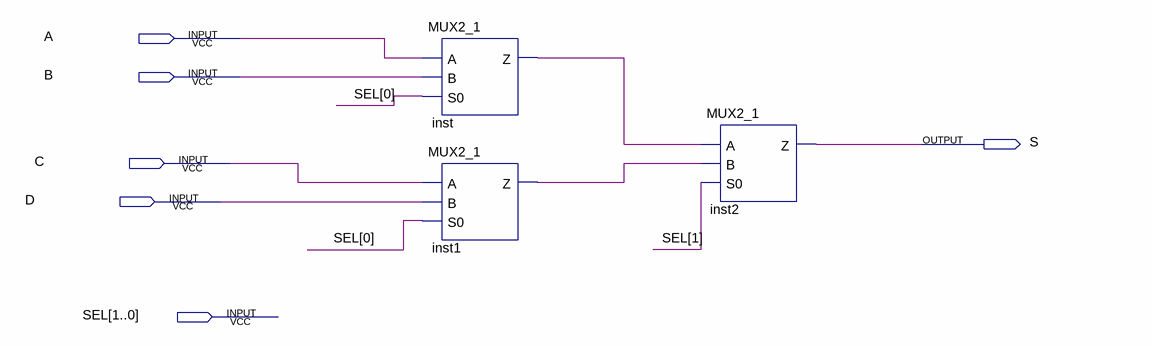
[diagram p0: schematic sheet]
// Quartus schematic MUX4_1.bdf as structural Verilog: 3 symbols, 6 pins
module MUX4_1 (
  input  A,
  input  B,
  input  C,
  input  D,
  input  [1:0] SEL,
  output S
);

  wire inst1_z, inst_z;

  MUX2_1 inst (.A(A), .B(B), .S0(SEL[0]), .Z(inst_z));
  MUX2_1 inst1 (.A(C), .B(D), .S0(SEL[0]), .Z(inst1_z));
  MUX2_1 inst2 (.A(inst_z), .B(inst1_z), .S0(SEL[1]), .Z(S));
endmodule
